# Altium schematic sheet pca10040_sheet3_pin_map.SchDoc: PCA10056 - Pin Map
size A4; Organization: Nordic Semiconductor; DocumentNumber: 3; Revision: 1.2.1; SheetNumber: 3; SheetTotal: 7; CompanyName: Nordic Semiconductor; DrawnBy: RUBR; ProjectNumber: 4397; PCBRevision: 0256RUBR; DocumentSize: A4; PCAName: PCA10040; PCBNumber: 400150; ProjectName: nRF52840-DK
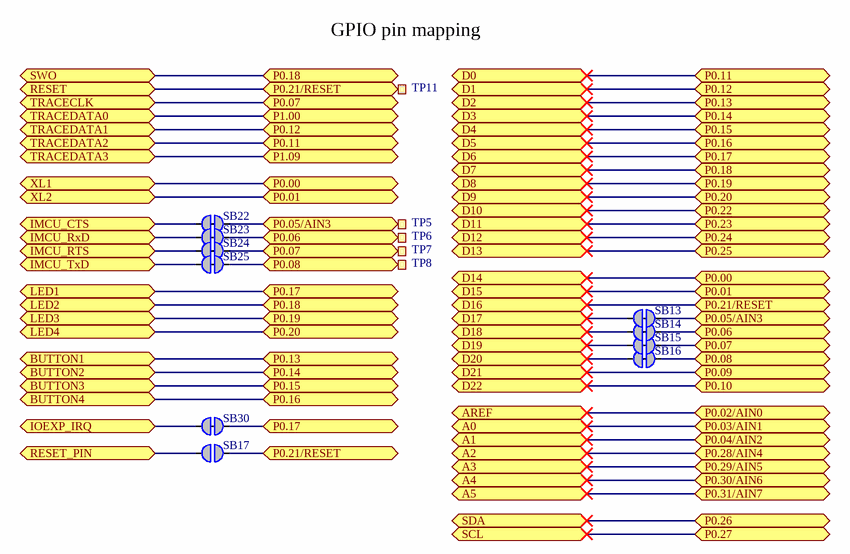
[diagram p0: pca10040_sheet3_pin_map.SchDoc]

## Parts
SB13  Solderbridge  [Solderbridge_Shorted]  (value not drawn)  (net tie, no BOM)
SB14  Solderbridge  [Solderbridge_Shorted]  (value not drawn)  (net tie, no BOM)
SB15  Solderbridge  [Solderbridge_Shorted]  (value not drawn)  (net tie, no BOM)
SB16  Solderbridge  [Solderbridge_Shorted]  (value not drawn)  (net tie, no BOM)
SB17  Solderbridge  [Solderbridge]  (value not drawn)  (no BOM)
SB22  Solderbridge  [Solderbridge_Shorted]  (value not drawn)  (net tie, no BOM)
SB23  Solderbridge  [Solderbridge_Shorted]  (value not drawn)  (net tie, no BOM)
SB24  Solderbridge  [Solderbridge_Shorted]  (value not drawn)  (net tie, no BOM)
SB25  Solderbridge  [Solderbridge_Shorted]  (value not drawn)  (net tie, no BOM)
SB30  Solderbridge  [Solderbridge_Shorted]  (value not drawn)  (net tie, no BOM)
TP5  Ø1.0mm,SMD  [TP_SMD_Ø1.0mm]  (value not drawn)  (no BOM)
TP6  Ø1.0mm,SMD  [TP_SMD_Ø1.0mm]  (value not drawn)  (no BOM)
TP7  Ø1.0mm,SMD  [TP_SMD_Ø1.0mm]  (value not drawn)  (no BOM)
TP8  Ø1.0mm,SMD  [TP_SMD_Ø1.0mm]  (value not drawn)  (no BOM)
TP11  Ø1.0mm,SMD  [TP_SMD_Ø1.0mm]  (value not drawn)  (no BOM)

## Ports
A0 (bidir), A1 (bidir), A2 (bidir), A3 (bidir), A4 (bidir), A5 (bidir), AREF (bidir), BUTTON1 (bidir), BUTTON2 (bidir), BUTTON3 (bidir), BUTTON4 (bidir), D0 (bidir), D1 (bidir), D2 (bidir), D3 (bidir), D4 (bidir), D5 (bidir), D6 (bidir), D7 (bidir), D8 (bidir), D9 (bidir), D10 (bidir), D11 (bidir), D12 (bidir), D13 (bidir), D14 (bidir), D15 (bidir), D16 (bidir), D17 (bidir), D18 (bidir), D19 (bidir), D20 (bidir), D21 (bidir), D22 (bidir), IMCU_CTS (bidir), IMCU_RTS (bidir), IMCU_RxD (bidir), IMCU_TxD (bidir), IOEXP_IRQ (bidir), LED1 (bidir), LED2 (bidir), LED3 (bidir), LED4 (bidir), P0.00 (bidir), P0.01 (bidir), P0.02/AIN0 (bidir), P0.03/AIN1 (bidir), P0.04/AIN2 (bidir), P0.05/AIN3 (bidir), P0.06 (bidir), P0.07 (bidir), P0.08 (bidir), P0.09 (bidir), P0.10 (bidir), P0.11 (bidir), P0.12 (bidir), P0.13 (bidir), P0.14 (bidir), P0.15 (bidir), P0.16 (bidir), P0.17 (bidir), P0.18 (bidir), P0.19 (bidir), P0.20 (bidir), P0.21/RESET (bidir), P0.22 (bidir), P0.23 (bidir), P0.24 (bidir), P0.25 (bidir), P0.26 (bidir), P0.27 (bidir), P0.28/AIN4 (bidir), P0.29/AIN5 (bidir), P0.30/AIN6 (bidir), P0.31/AIN7 (bidir), P1.00 (bidir), P1.09 (bidir), RESET (bidir), RESET_PIN (bidir), SCL (bidir), SDA (bidir), SWO (bidir), TRACECLK (bidir), TRACEDATA0 (bidir), TRACEDATA1 (bidir), TRACEDATA2 (bidir), TRACEDATA3 (bidir), XL1 (bidir), XL2 (bidir)

## Nets
A0: port A0, port P0.03/AIN1
A1: port A1, port P0.04/AIN2
A2: port A2, port P0.28/AIN4
A3: port A3, port P0.29/AIN5
A4: port A4, port P0.30/AIN6
A5: port A5, port P0.31/AIN7
AREF: port AREF, port P0.02/AIN0
BUTTON1: port P0.13, port BUTTON1, port D2
BUTTON2: port P0.14, port BUTTON2, port D3
BUTTON3: port P0.15, port BUTTON3, port D4
BUTTON4: port P0.16, port BUTTON4, port D5
D0: port TRACEDATA2, port P0.11, port D0
D1: port TRACEDATA1, port P0.12, port D1
D6: SB30.1 ; port LED1, port D6, port P0.17
D7: port SWO, port P0.18, port LED2, port D7
D8: port LED3, port D8, port P0.19
D9: port LED4, port D9, port P0.20
D10: port D10, port P0.22
D11: port D11, port P0.23
D12: port D12, port P0.24
D13: port D13, port P0.25
D14: port P0.00, port XL1, port D14
D15: port P0.01, port XL2, port D15
D16: SB17.2 TP11.1 ; port RESET, port P0.21/RESET, port D16
D17: SB13.1 ; port D17
D18: SB14.1 ; port D18
D19: SB15.1 ; port D19
D20: SB16.1 ; port D20
D21: port D21, port P0.09
D22: port D22, port P0.10
IMCU_CTS: SB22.2 ; port IMCU_CTS
IMCU_RTS: SB24.2 ; port IMCU_RTS
IMCU_RxD: SB23.2 ; port IMCU_RxD
IMCU_TxD: SB25.2 ; port IMCU_TxD
IOEXP_IRQ: SB30.2 ; port IOEXP_IRQ
P0.05/AIN3: SB13.2 SB22.1 TP5.1 ; port P0.05/AIN3
P0.06: SB14.2 SB23.1 TP6.1 ; port P0.06
P0.07: SB15.2 SB24.1 TP7.1 ; port P0.07, port TRACECLK
P0.08: SB16.2 SB25.1 TP8.1 ; port P0.08
P0.26: port P0.26, port SDA
P0.27: port P0.27, port SCL
P1.00: port TRACEDATA0, port P1.00
P1.09: port TRACEDATA3, port P1.09
RESET_PIN: SB17.1 ; port RESET_PIN

## Notes on the sheet
- (near TP11) GPIO pin mapping
- Title
- Size
- Date:
- Project Number
- Sheet         of
- Revision
- File:
- Drawn By:

## Library data of the parts
SB13-SB16 SB22-SB25 SB30 = Solderbridge Shorted: Shorted Solderbridge; Artikkelnr Noca: N.A.; Part Number: Solderbridge Shorted; Manufacturer: *; Manufacturer Part Number: *; Datasheet: *; Footprint Doc: Solderbridge_Shorted; LatestRevisionDate: 2012-08-07; Pin Count: 2; Publisher: Nordic Semiconductor; Published: 2012-08-07; Value: Solderbridge; Note: *; Supplier: *; Supplier part number: *; 2nd source Supplier: *; 2nd source part number: *; Artikkelnr Simpro: N.A.
SB17 = Solderbridge: Artikkelnr Noca: N.A.; Part Number: Solderbridge; Manufacturer: *; Manufacturer Part Number: *; Datasheet: *; Footprint Doc: Solderbridge; LatestRevisionDate: 2009-12-14; Pin Count: 2; Publisher: Nordic Semiconductor; Published: 2009-12-14; Value: Solderbridge; Note: *; Supplier: *; Supplier part number: *; 2nd source Supplier: *; 2nd source part number: *; Artikkelnr Simpro: N.A.
TP5-TP8 TP11 = TP_SMD_Ø1.0MM: 1.0mm circular SMD testpad; Manufacturer: Nordic Semiconductor; Artikkelnr Noca: N.A.; Part Number: TP_SMD_Ø1.0MM; Manufacturer Part Number: *; Datasheet: *; LatestRevisionDate: 2013-06-11; Pin Count: 1; Publisher: Nordic Semiconductor; Published: 2013-06-11; Value: Ø1.0mm,SMD; Note: *; Supplier: *; Supplier part number: *; 2nd source Supplier: *; 2nd source part number: *; Footprint Doc: TP_SMD_Ø1.0mm; Artikkelnr Simpro: N.A.